# EAGLE design Game Cube USB-C (EAGLE 6.2)
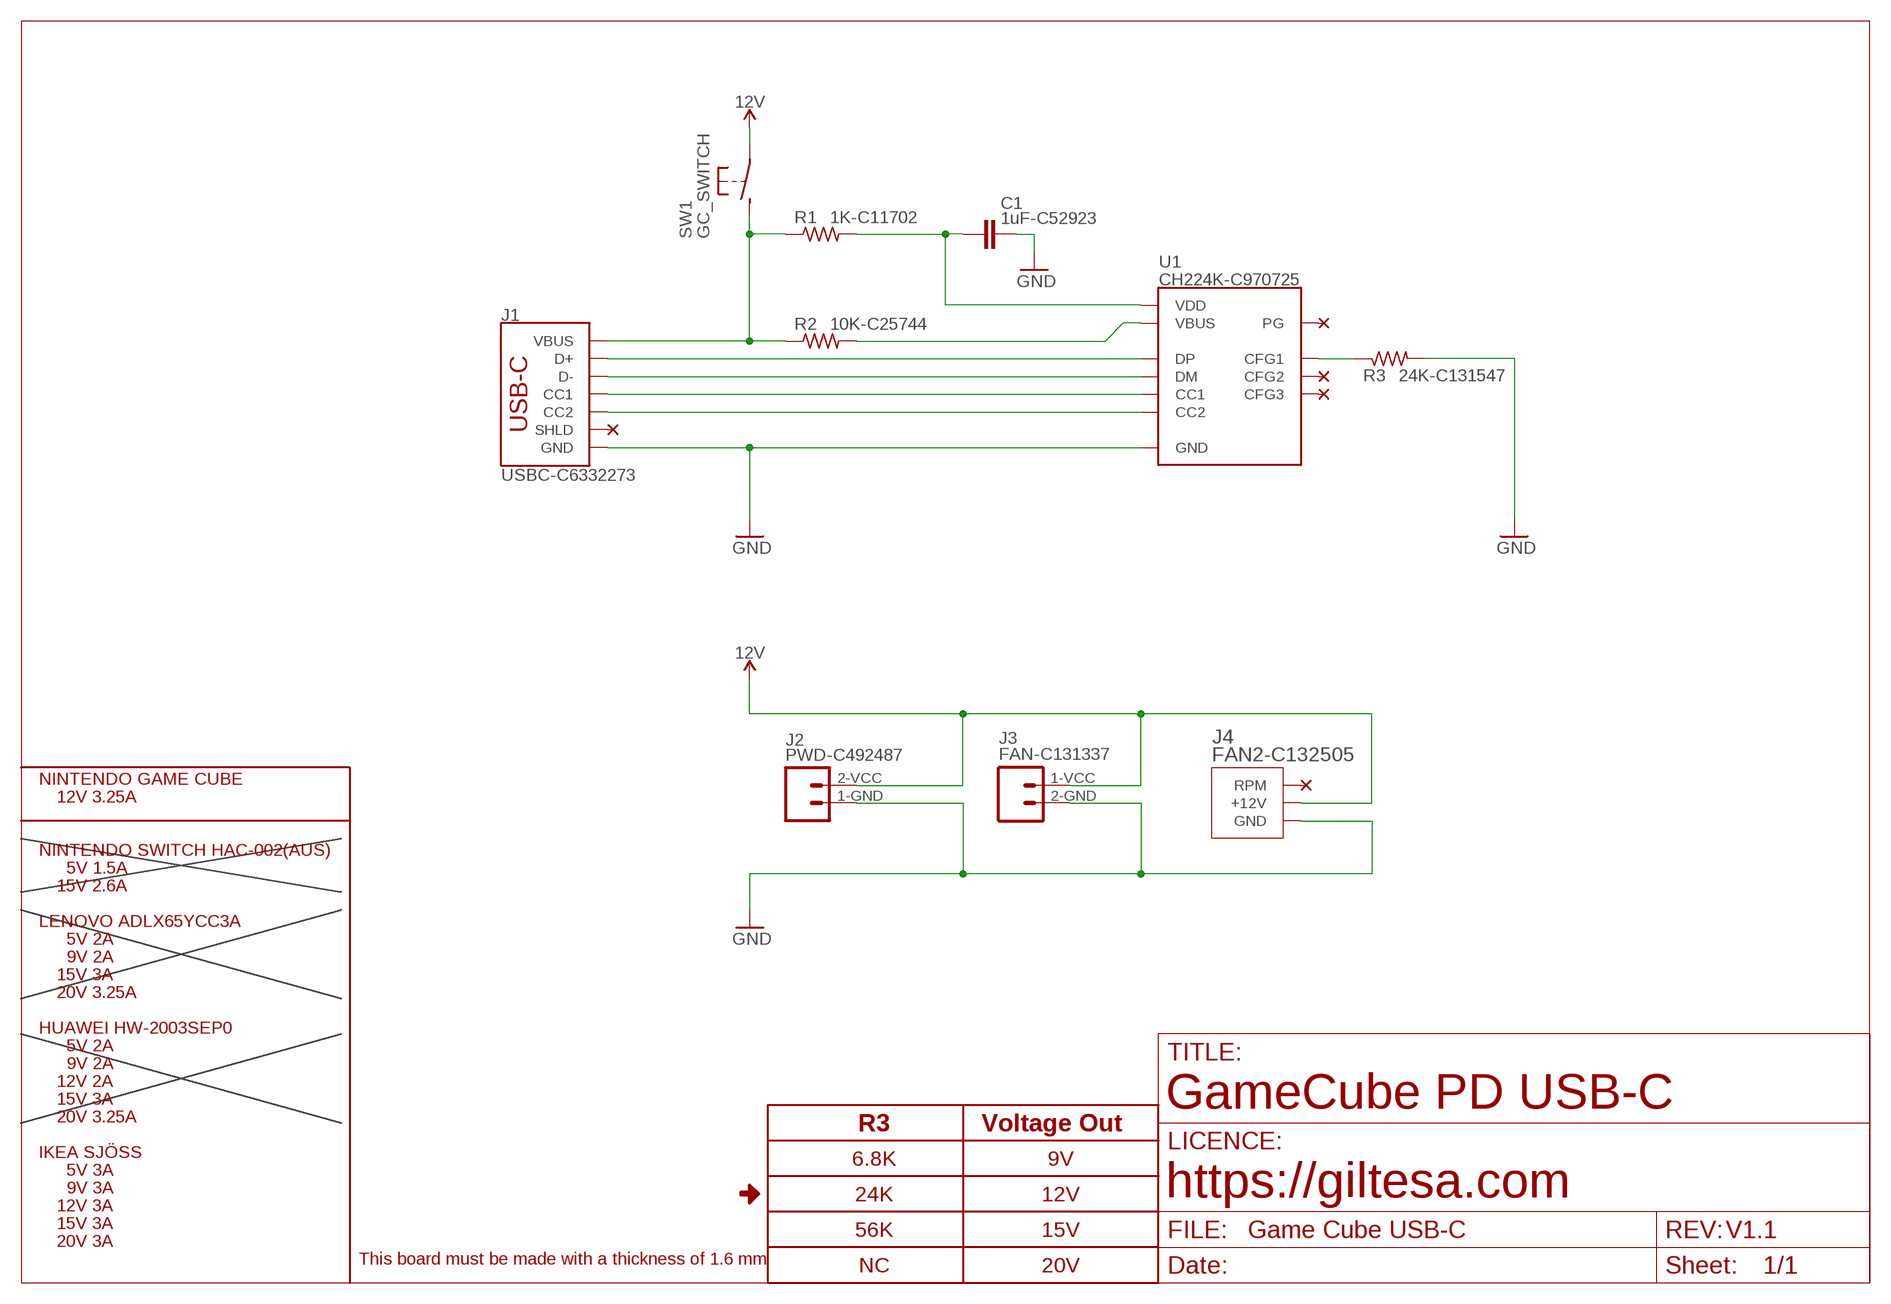
[diagram p0: schematic, sheet 1]

## Parts
C1  1uF-C52923  C0402_S  [C0402_S]
J1  USBC-C6332273  USB-C_16P_DADA_3MM  [USB-C_16P_3MM]
J2  PWD-C492487  JST-2_GC_PWD_2.54MM  [GC_PWD_CONNECTOR]
J3  FAN-C131337  JST-2_GC_FAN_2MM  [GC_FAN_CONNECTOR]
J4  FAN2-C132505  MOLEX-22-29-2031  [MOLEX-W-2510S03P]
R1  1K-C11702  R0402  [R0402]
R2  10K-C25744  R0402  [R0402]
R3  24K-C131547  R0402  [R0402]
SW1  GC_SWITCH  [GC_SWITCH]
U1  CH224K-C970725  CH224K  [ESSOP10]

## Nets
12V: J2.2-VCC J3.1-VCC J4.P2-12V(+12V) SW1.P$1
CC1: J1.A5-CC1(CC1) U1.7(CC1)
CC2: J1.B5-CC2(CC2) U1.6(CC2)
D+: J1.A6-DP1(D+) J1.B6-DP2(D+) U1.4(DP)
D-: J1.A7-DN1(D-) J1.B7-DN2(D-) U1.5(DM)
GND: C1.2 J1.GND1(GND) J1.GND2(GND) J2.1-GND J3.2-GND J4.P3-GND(GND) R3.2 U1.0(GND)
N$1: R3.1 U1.9(CFG1)
N$6: R2.2 U1.8(VBUS)
VBUS: J1.VBUS1(VBUS) J1.VBUS2(VBUS) R1.1 R2.1 SW1.P$2
VDD: C1.1 R1.2 U1.1(VDD)
Unconnected: J1.SHLD1(SHLD) J1.SHLD2(SHLD) J1.SHLD3(SHLD) J1.SHLD4(SHLD) J4.P1-RPM(RPM) U1.2(CFG2) U1.3(CFG3) U1.10(PG)

## Notes on the sheet
- NINTENDO GAME CUBE
- 12V 3.25A
- NINTENDO SWITCH HAC-002(AUS)
- 5V 1.5A
- 15V 2.6A
- LENOVO ADLX65YCC3A
- 5V 2A
- 9V 2A
- 15V 3A
- 20V 3.25A
- HUAWEI HW-2003SEP0
- 5V 2A
- 9V 2A
- 12V 2A
- 15V 3A | GameCube PD USB-C
- 20V 3.25A | R3 | Voltage Out
- IKEA SJÖSS | 6.8K | 9V
- 5V 3A
- 9V 3A | 24K | 12V | https://giltesa.com
- 12V 3A
- 15V 3A | 56K | 15V
- V1.1
- 20V 3A
- This board must be made with a thickness of 1.6 mm | NC | 20V

## Library data of the parts
C1 = ,giltesa:C0402
J1 = ,giltesa:USB-C_16P
J2 J3 = ,giltesa:JST-2
J4 = ,giltesa:MOLEX-22-29-2031; COPYRIGHT: Copyright (C) 2024 Ultra Librarian. All rights reserved.; MANUFACTURER_PART_NUMBER: 22292031; MFR_NAME: Molex Connector Corporation
R1-R3 = ,giltesa:R0402
SW1 = ,giltesa:GC_SWITCH
U1 = ,giltesa:CH224K

## Net classes
1 power: width 0.61 mm, drill 0.406 mm, clearance 0.203 mm
2 gnd: width 0.305 mm, drill 0.406 mm, clearance 0.203 mm
3 power usb: width 0.508 mm, drill 0.406 mm, clearance 0.203 mm

## Board
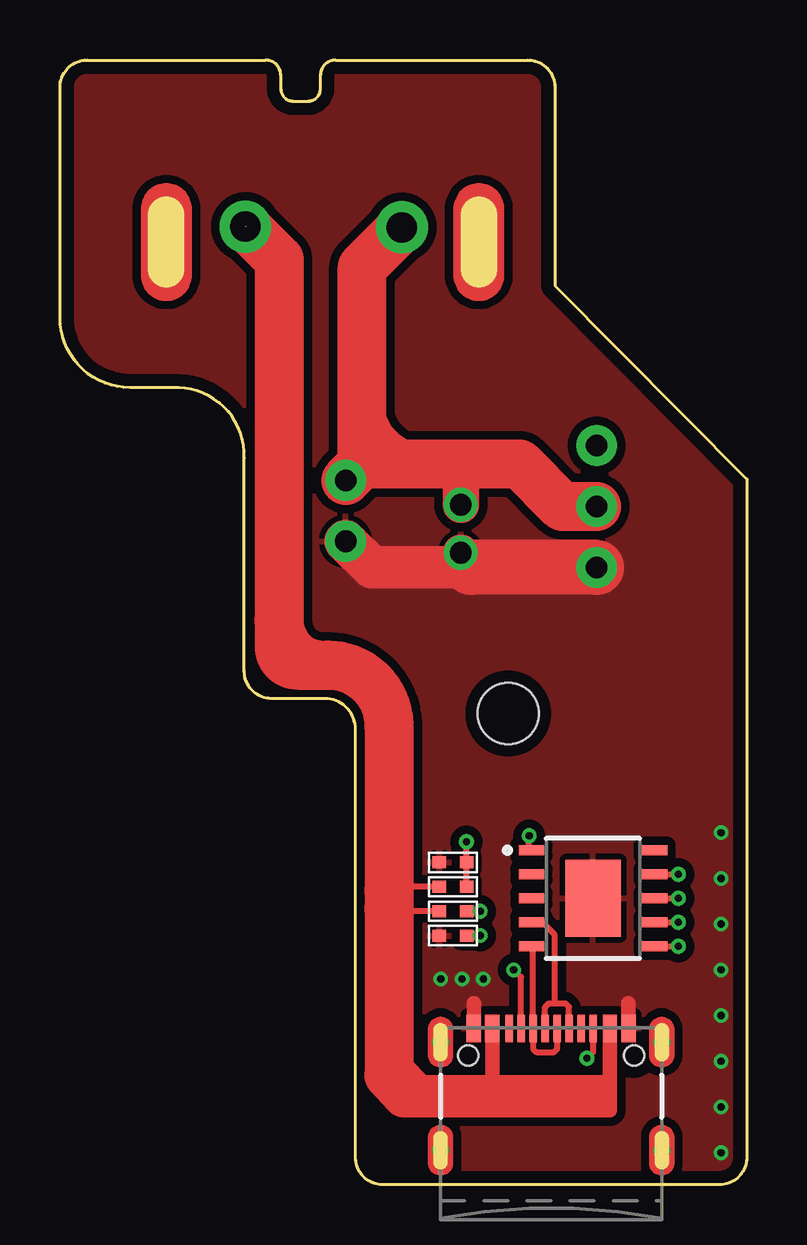
[diagram p1: board, top side]
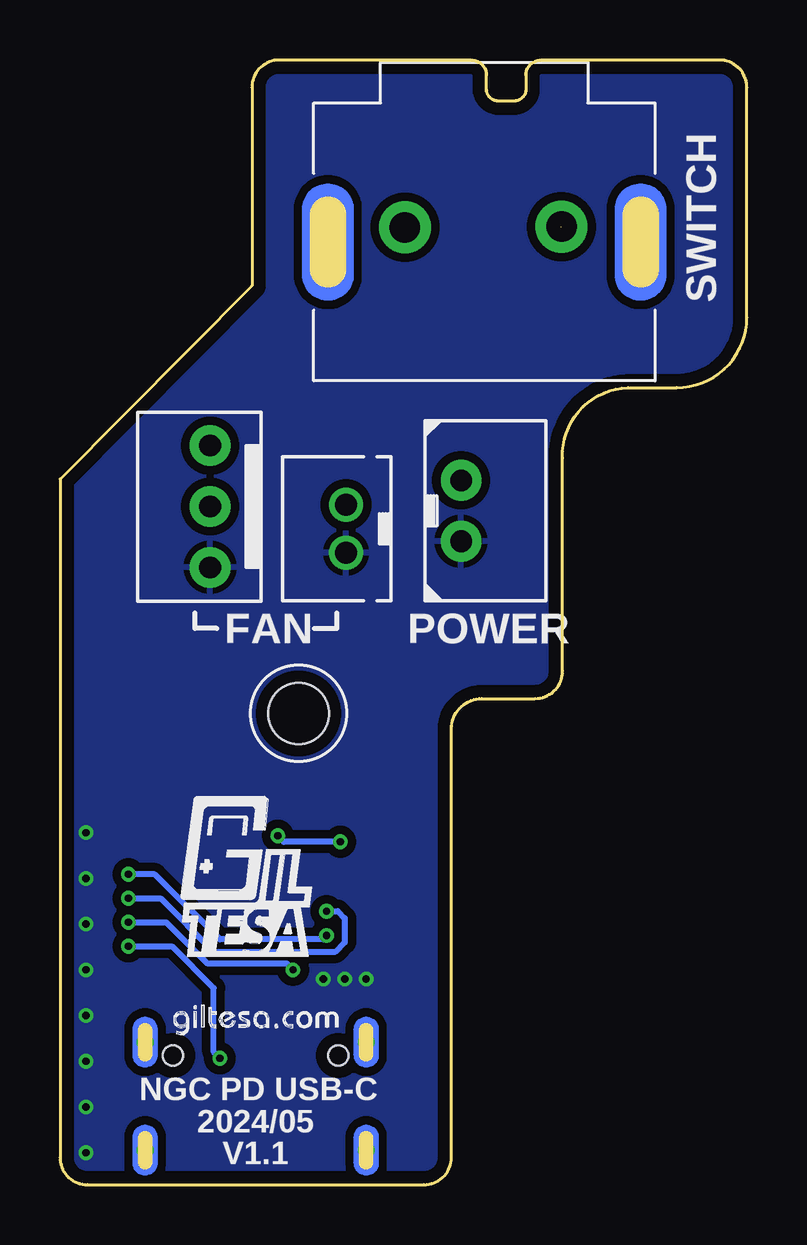
[diagram p2: board, bottom side, seen from below]

Size 28.64 x 46.86 mm. Coordinates in mm from the lower left corner, seen from the top.
Outline: 27.5,0 13.46,0 arc-90 12.32,1.14 12.32,18.99 arc90 11.05,20.26 8.83,20.26 arc-90 7.68,21.4 7.68,30.29 arc90 4.95,33.21 2.92,33.21 arc-90 0,36.13 0,45.72 arc-90 1.14,46.86 8.57,46.86 arc-90 9.21,46.23 9.21,45.66 arc90 9.71,45.15 10.35,45.15 arc90 10.86,45.66 10.86,46.23 arc-90 11.49,46.86 19.5,46.86 arc-90 20.64,45.72 20.64,37.47 28.64,29.4 28.64,1.14 arc-90 27.5,0
Copper layers (1*16): Top 0.035mm / dielectric 1.6mm / Bottom 0.035mm
Design rules: minimum track width 6mil, minimum drill 12mil, track to track 6mil, track to pad 6mil, pad to pad 6mil, via to via 8mil, smd to smd 0mil, copper to edge 20mil, drill to drill 10mil, minimum pad ring 6mil, minimum via ring 6mil, stop-mask expansion 0mil, vias tented up to drill 100mil, thermal gap 10mil
tKeepout: 4 lines

### Footprints (pad centres in the part's own frame; a part is rotated, then mirrored left to right if it is on the bottom)
C0402_S = smd 0.559 x 0.5: 1 -0.567,0; 2 0.567,0
USB-C_16P_3MM = smd 0.3 x 1.143: A5-CC1 -1.25,2.732; A6-DP1 -0.25,2.732; A7-DN1 0.25,2.732; A8-SBU1 1.25,2.732; B5-CC2 1.75,2.732; B6-DP2 0.75,2.732; B7-DN2 -0.75,2.732; B8-SBU2 -1.75,2.732 | smd 0.6 x 1.143: GND1 -3.225,2.732; GND2 3.225,2.732; VBUS1 -2.45,2.732; VBUS2 2.45,2.732 | drill 0.4 pad 0.6: SHLD1 -4.61,2.16; SHLD2 4.61,2.16; SHLD3 -4.61,-2.34; SHLD4 4.61,-2.34 | hole 0.838: -3.45,1.6; 3.45,1.6
GC_PWD_CONNECTOR = drill 0.9 pad 1.7: 1-GND -1.27,0; 2-VCC 1.27,0 | smd 0.127 x 0.127: NA -1.27,-0.457
GC_FAN_CONNECTOR = drill 0.9 pad 1.4: 1-VCC 1,0; 2-GND -1,0 | smd 0.127 x 0.127: NA 1,0.457
MOLEX-W-2510S03P = smd 0.127 x 0.127: NA 0,-0.457 | drill 0.9 pad 1.7: P1-RPM -2.54,0; P2-12V 0,0; P3-GND 2.54,0
R0402 = smd 0.559 x 0.5: 1 -0.567,0; 2 0.567,0
GC_SWITCH = drill 1.27 pad 2.159: P$1 -3.312,0.612; P$2 3.216,0.638 | drill 0.762: SHLD1 -6.516,0; SHLD2 6.516,0
ESSOP10 = smd 3.2 x 2.3: 0 0,0 | smd 0.43 x 1.05: 1 -2,-2.566; 2 -1,-2.566; 3 0,-2.566; 4 1,-2.566; 5 2,-2.566; 6 2,2.566; 7 1,2.566; 8 0,2.566; 9 -1,2.566; 10 -2,2.566
GC_DRILL_SCREW = hole 2.54: 0,0

### Placement (x,y rotation side)
C1  16.38,13.43 180 top
J1  20.48,3.78 0 top
J2  11.91,28.08 90 bottom
J3  16.71,27.33 90 bottom
J4  22.38,28.26 270 bottom
R1  16.38,12.41 0 top
R2  16.38,11.4 0 top
R3  16.38,10.38 180 top
SW1  10.95,39.28 0 bottom
U1  22.23,11.94 270 top
U$6  [GC_DRILL_SCREW]  18.69,19.64 0 top
U$8  [GILTESA_LOGO_MASK_7MM]  24.25,9.39 0 bottom
U$28  [GILTESA.COM_MASK_7MM]  23.95,6.16 0 bottom

### Tracks (layer width: path | path; a pad name or v marks a point on that pad's centre or on a via)
12V
  Top 1.524: J3.1-VCC 16.71,29.98 18.03,30.04
  Top 2.032: 12.6,30.04 14.22,30.04 | 14.22,30.04 18.03,30.04 19.18,30.04 20.96,28.26 J4.P2-12V | 12.6,30.04 12.6,38.23 SW1.P$1 | J2.2-VCC 12.6,30.04 | 14.22,30.04 arc-45 12.7,31.56
CC1  (via drill 0.3)
  Top 0.254: J1.A5-CC1 19.23,8.65 v18.92,8.95 | U1.7 v25.78,10.94
  Bottom 0.254: v25.78,10.94 24.21,10.94 22.48,9.21 19.18,9.21 v18.92,8.95
CC2  (via drill 0.3)
  Top 0.254: J1.B5-CC2 22.23,5.53 v21.97,5.27 | U1.6 v25.78,9.94
  Bottom 0.254: v21.97,5.27 22.23,5.52 22.23,8.19 23.97,9.94 v25.78,9.94
D+
  Top 0.254: 19.73,10.94 U1.4 20.12,10.94 20.61,10.44 20.61,7.59 20.57,7.56 | J1.B6-DP2 21.23,7.41 21.08,7.56 20.57,7.56 | J1.A6-DP1 20.23,7.4 20.38,7.56 20.57,7.56
D-
  Top 0.254: U1.5 19.97,9.94 19.73,9.8 J1.B7-DN2 19.73,5.65 19.86,5.52 20.6,5.52 20.73,5.65 J1.A7-DN1
GND  (via drill 0.3)
  Top 0.597: J1.GND1 17.25,7.56 | J1.GND2 23.7,7.56
  Top 1.524: J3.2-GND 16.71,26.15 17.14,25.72
  Top 1.778: 17.14,25.72 13,25.72 J2.1-GND
  Top 2.286: J4.P3-GND 17.14,25.72
  other vias: 27.56,1.33 27.56,3.24 27.56,5.14 27.56,7.05 27.56,8.95 27.56,10.86 17.65,8.57 16.76,8.57 15.87,8.57 27.56,12.76 27.56,14.67
  pour Top (isolate 0.356): -2.13,48.97 30.85,48.97 30.85,-2.06 -2.13,-2.06
  pour Bottom (isolate 0.356): -1.13,47.97 29.85,47.97 29.85,-1.06 -1.13,-1.06
N$1  (via drill 0.3)
  Top 0.254: U1.9 v25.78,12.94 | R3.1 v17.53,10.38
  Bottom 0.254: v17.53,10.38 17.53,10.35 17.65,10.22 21.97,10.22 24.68,12.94 v25.78,12.94
N$6  (via drill 0.3)
  Top 0.254: U1.8 v25.78,11.94 | R2.2 v17.53,11.4
  Bottom 0.254: v25.78,11.94 24.45,11.94 22.23,9.72 17.14,9.72 16.76,10.1 16.76,11.11 17.05,11.4 v17.53,11.4
VBUS  (1 unrouted)
  Top 0.254: R2.1 13.72,11.4 13.72,11.49 | R1.1 13.72,12.41 13.72,12.26
  Top 0.508: 22.93,3.18 22.16,3.68
  Top 0.597: J1.VBUS1 18.03,3.94 | J1.VBUS2 22.93,3.18
  Top 0.61: 18.03,3.94 18.16,3.68 | 22.17,3.1 22.92,3.09 22.92,3.18 22.93,3.18 | 22.87,4.26 22.12,4.27 22.16,4.22 22.16,3.68
  Top 1.778: 13.72,4.57 13.59,4.51 14.35,3.68 14.86,3.68 | 14.86,3.68 18.16,3.68 22.16,3.68 | 14.86,3.68 13.84,4.76
  Top 2.032: 9.14,23.69 9.14,38.54 7.77,39.92 | 9.14,23.69 9.14,22.42 arc90 9.91,21.65 10.79,21.65 | 10.79,21.65 11.18,21.65 arc-90 13.72,19.11 13.72,12.26 13.72,11.49 13.72,4.57 | 9.14,23.69 arc90 10.79,21.65
VDD  (via drill 0.3)
  Top 0.254: U1.1 19.56,14.04 v19.56,14.54 | R1.2 C1.1 v16.95,14.29
  Bottom 0.254: v16.95,14.29 19.3,14.29 v19.56,14.54

### Text on the board
bPlace: SWITCH | POWER | FAN | NGC PD USB-C | 2024/05 | V1.1